# EAGLE design nosepoke 1.12 (EAGLE 9.2.2)
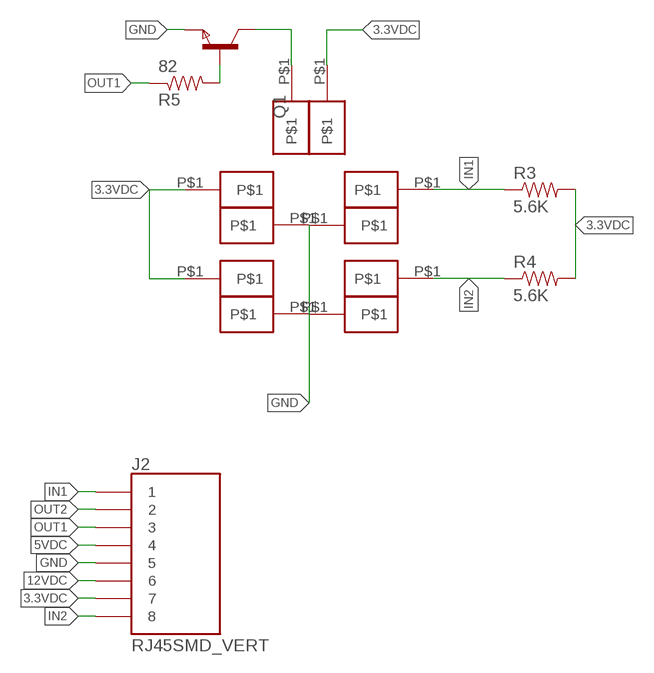
[diagram p0: schematic, sheet 1]

## Parts
J2  RJ45SMD_VERT  [RJ45_SMD_VERT]
Q1  NPNSOT323  [SOT323]
R3  5.6K  RESISTOR0805-RES  [0805]
R4  5.6K  RESISTOR0805-RES  [0805]
R5  82  RESISTOR0805-RES  [0805]
U$1  PAD  [PAD]
U$2  PAD  [PAD]
U$3  PAD  [PAD]
U$4  PAD  [PAD]
U$5  PAD  [PAD]
U$6  PAD  [PAD]
U$7  PAD  [PAD]
U$8  PAD  [PAD]
U$9  PAD  [PAD]
U$10  PAD  [PAD]

## Nets
3.3VDC: J2.7 R3.2 R4.2 U$3.P$1 U$6.P$1 U$10.P$1
5VDC: J2.4
12VDC: J2.6
GND: J2.5 Q1.3(E) U$1.P$1 U$2.P$1 U$5.P$1 U$8.P$1
IN1: J2.1 R3.1 U$7.P$1
IN2: J2.8 R4.1 U$4.P$1
N$3: Q1.2(B) R5.2
N$4: Q1.1(C) U$9.P$1
OUT1: J2.3 R5.1
OUT2: J2.2

## Library data of the parts
J2 = Andy-library:RJ45
Q1 = Cerebro-library:NPNSOT323: NPN TRANSISTOR; MPN: DSS4160U-7; OC_FARNELL: 1710696; OC_NEWARK: 25R4558
R3-R5 = Andy-library:RESISTOR: Resistor Basic schematic elements and footprints for 0603, 1206, and PTH resistors.
U$1-U$10 = Andy-library:PAD

## Board
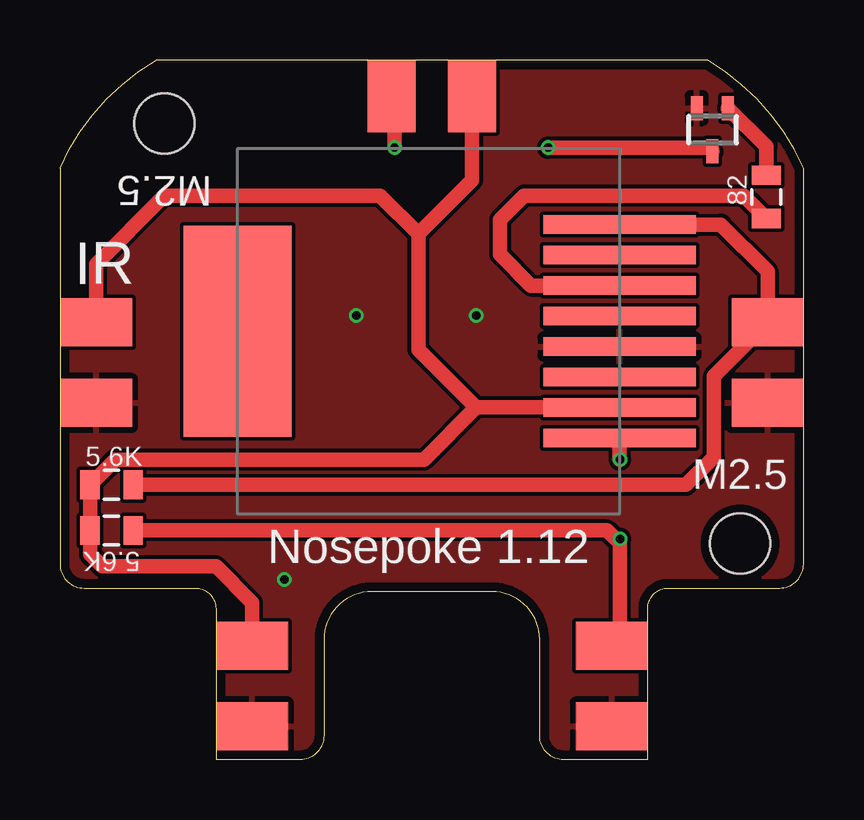
[diagram p1: board, top side]
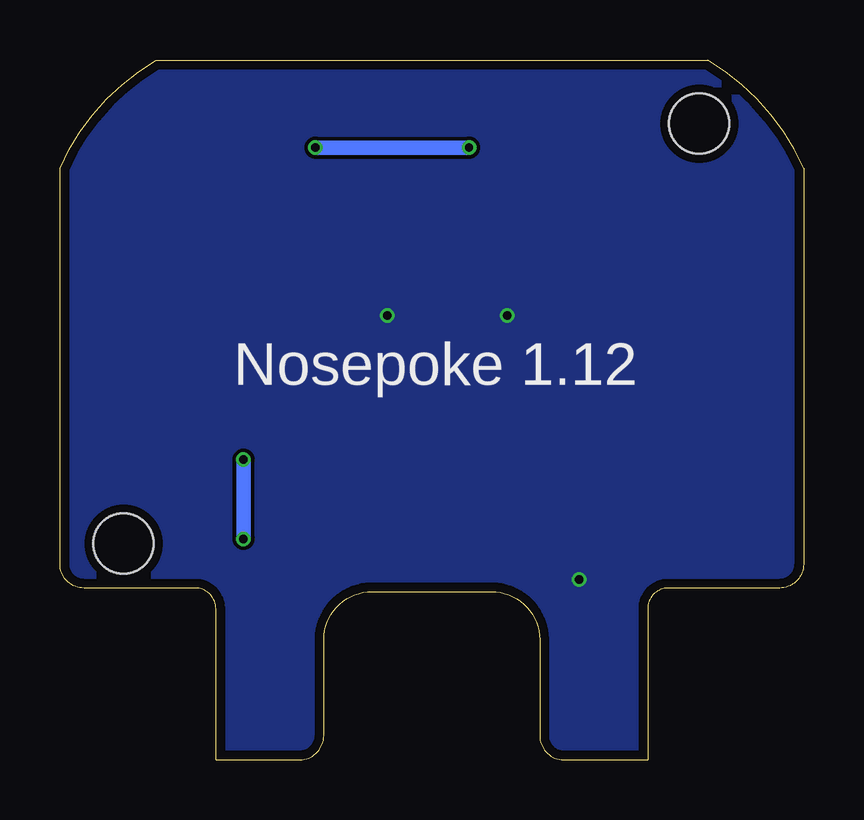
[diagram p2: board, bottom side, seen from below]

Size 31 x 29.15 mm. Coordinates in mm from the lower left corner, seen from the top.
Outline: 27,29.15 4,29.15 arc35 0,24.65 0,8.15 arc90 1,7.15 5.64,7.15 arc-90 6.5,6.29 6.5,0 10,0 arc90 11,1 11,5 arc-90 13,7 18,7 arc-90 20,5 20,1 arc90 21,0 24.5,0 24.5,6.29 arc-90 25.36,7.15 30,7.15 arc90 31,8.15 31,24.65 arc35 27,29.15
Copper layers (1*16): Top 0.035559375mm / dielectric 1.6mm / Bottom 0.035559375mm
Design rules "oshpark-2layer *": minimum track width 6mil, minimum drill 10mil, track to track 6mil, track to pad 6mil, pad to pad 6mil, via to via 6mil, smd to smd 6mil, copper to edge 15mil, drill to drill 6mil, minimum pad ring 5mil, minimum via ring 5mil, stop-mask expansion 2.5mil, vias tented up to drill 0mil, thermal gap 10mil
Holes 2.5 mm at 4.35,26.5 28.35,9

### Footprints (pad centres in the part's own frame; a part is rotated, then mirrored left to right if it is on the bottom)
RJ45_SMD_VERT = smd 0.76 x 6.35: 1 -4.445,15.93; 2 -3.175,15.93; 3 -1.905,15.93; 4 -0.635,15.93; 5 0.635,15.93; 6 1.905,15.93; 7 3.175,15.93; 8 4.445,15.93 | smd 8.8 x 4.5: P$2 0,0
SOT323 = smd 0.5 x 1: 1 0,0.9; 2 -0.65,-0.9; 3 0.65,-0.9
0805 = smd 0.8 x 1.2: 1 -0.9,0; 2 0.9,0
PAD = smd 2 x 3: P$1 0,1.5

### Placement (x,y rotation side)
J2  7.4,17.85 270 top
Q1  27.2,26.25 180 top
R3  2.15,11.45 180 top
R4  2.15,9.55 180 top
R5  29.45,23.45 90 top
U$1  21.5,1.39 270 top
U$2  9.5,1.39 90 top
U$3  9.5,4.74 90 top
U$4  21.5,4.74 270 top
U$5  0,14.87 270 top
U$6  0,18.22 270 top
U$7  31,18.22 90 top
U$8  31,14.87 90 top
U$9  13.83,29.15 180 top
U$10  17.18,29.15 180 top

### Tracks (layer width: path | path; a pad name or v marks a point on that pad's centre or on a via)
3.3VDC
  Top 0.61: J2.7 17.35,14.68 | 17.35,14.68 14.94,17.09 14.94,21.91 | 17.35,14.68 15.17,12.5 2.3,12.5 R3.2 R4.2 1.25,8.55 1.75,8.05 6.5,8.05 8,6.55 U$3.P$1 | 17.62,28.1 U$10.P$1 17.18,24.15 14.94,21.91 | U$6.P$1 1.5,20.65 4.35,23.5 13.35,23.5 14.94,21.91
GND  (via drill 0.35)
  other vias: 17.35,18.5 9.35,7.5 12.35,18.5
  pour Top: -2.65,-2.5 -2.65,30.5 35.35,30.5 35.35,-2.5
  pour Bottom: -3.65,31.5 37.35,31.5 37.35,-3.5 -3.65,-3.5
IN1
  Top 0.61: J2.1 27.55,22.3 29.5,20.35 U$7.P$1 27.26,15.98 27.26,12.61 26.1,11.45 R3.1
IN2  (via drill 0.35)
  Top 0.406: U$4.P$1 23.35,5.08
  Top 0.61: J2.8 23.33,12.52 v23.35,12.5 | R4.1 22.8,9.55 23.15,9.2 v23.35,9.2 23.35,5.08
  Bottom 0.61: v23.35,9.2 v23.35,12.5
N$3
  Top 0.61: R5.2 29.45,25.55 Q1.2
N$4  (via drill 0.35)
  Top 0.61: Q1.1 27.05,25.5 v20.35,25.5 | v13.95,25.5 13.95,27.53 U$9.P$1
  Bottom 0.61: v20.35,25.5 v13.95,25.5
OUT1
  Top 0.61: J2.3 19.65,19.75 18.35,21.05 18.35,22.5 19.35,23.5 28.5,23.5 R5.1

### Text on the board
tNames: M2.5 | IR | M2.5 | Nosepoke 1.12
bNames: Nosepoke 1.12